# Altium schematic sheet NC1-1-Top.SchDoc: Top
size A3; SheetNumber: 1; SheetTotal: 7
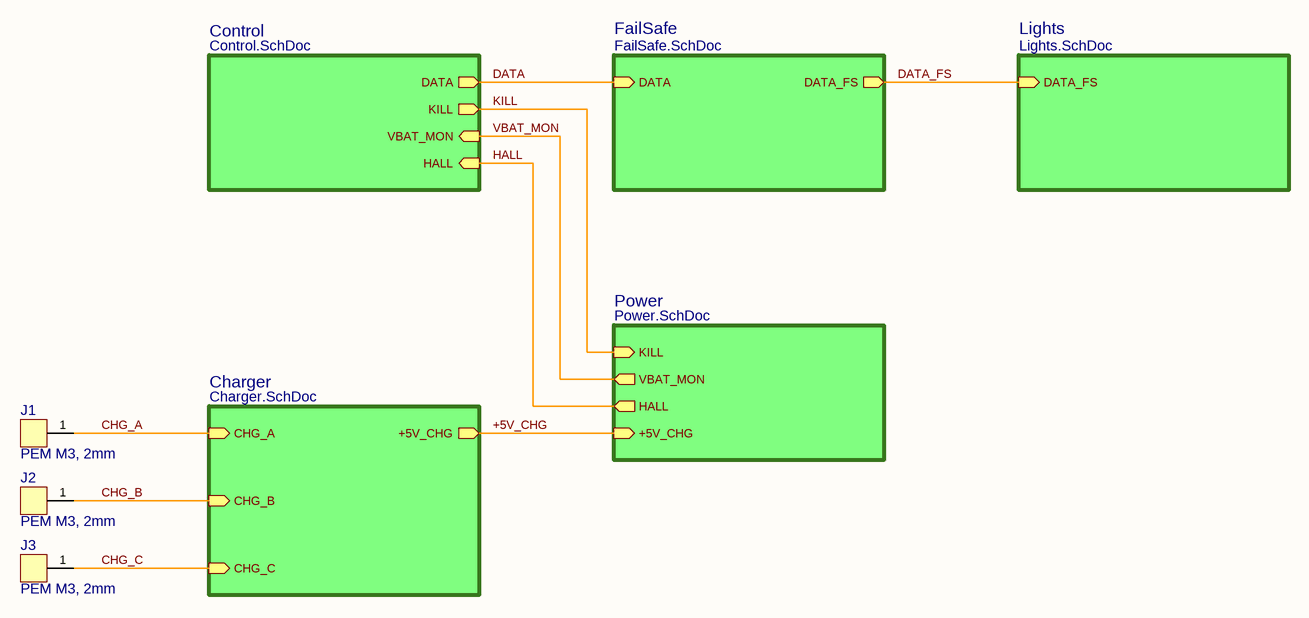
[diagram p0: NC1-1-Top.SchDoc]

## Parts
J1  PEM M3, 2mm  [MECH_SMTSO3020CTJ]
J2  PEM M3, 2mm  [MECH_SMTSO3020CTJ]
J3  PEM M3, 2mm  [MECH_SMTSO3020CTJ]

## Sub-sheets
Charger = Charger.SchDoc: +5V_CHG (out), CHG_A (in), CHG_B (in), CHG_C (in)
Control = Control.SchDoc: DATA (out), KILL (out), VBAT_MON (in), HALL (in)
FailSafe = FailSafe.SchDoc: DATA_FS (out), DATA (in)
Lights = Lights.SchDoc: DATA_FS (in)
Power = Power.SchDoc: KILL (in), +5V_CHG (in), VBAT_MON (out), HALL (out)

## Nets
+5V_CHG: sheet Charger/+5V_CHG, sheet Power/+5V_CHG
CHG_A: J1.1 ; sheet Charger/CHG_A
CHG_B: J2.1 ; sheet Charger/CHG_B
CHG_C: J3.1 ; sheet Charger/CHG_C
DATA: sheet Control/DATA, sheet FailSafe/DATA
DATA_FS: sheet FailSafe/DATA_FS, sheet Lights/DATA_FS
HALL: sheet Control/HALL, sheet Power/HALL
KILL: sheet Control/KILL, sheet Power/KILL
VBAT_MON: sheet Control/VBAT_MON, sheet Power/VBAT_MON

## Notes on the sheet
- Date:
- Size:
- A3
- Schema:
- Layout:

## Library data of the parts
J1-J3 = PEM M3, 2mm: Solder Nut M3x0.5, 2mm; Manufacturer: GENERIC; Part Number: PEM M3, 2mm; Manufacturer 2: PEM; Manufacturer Part Number 2: SMTSO-M3-2ET; Supplier 2: Mouser; Supplier Part Number 2: 153-SMTSO-M3-2ET; Manufacturer 3: Sinhoo; Manufacturer Part Number 3: SMTSO3020MTJ; Supplier 3: LCSC; Supplier Part Number 3: C2915633; JLC Type: Extended